# Altium schematic sheet EIT_Teensy_VCCS.SchDoc
size A3
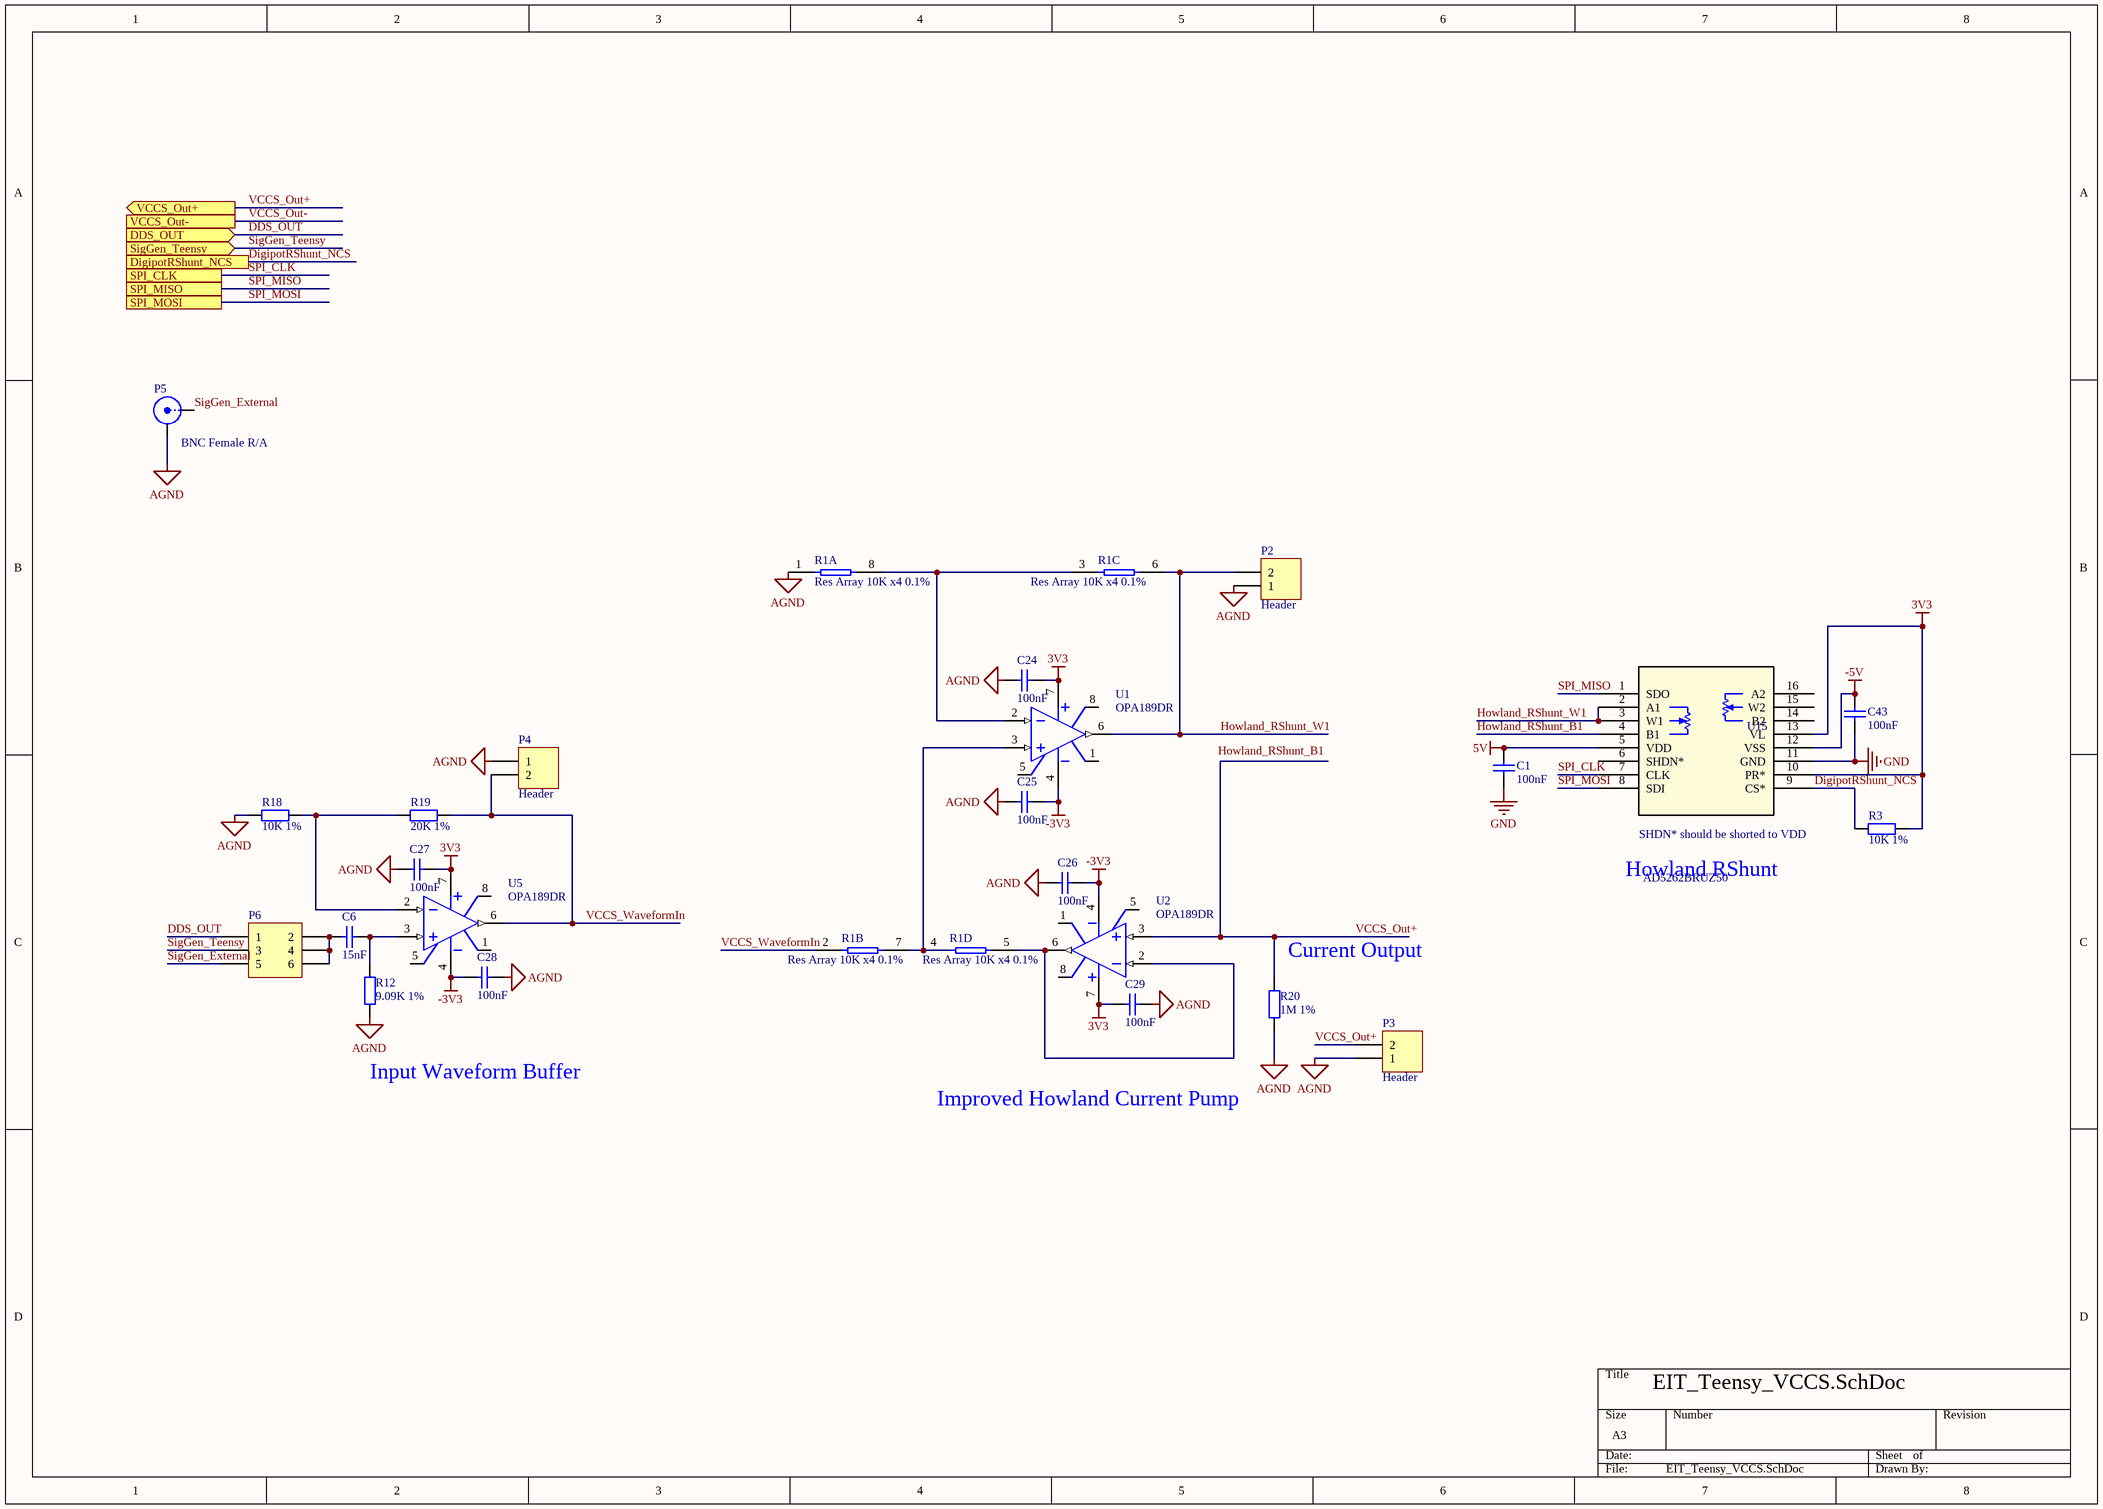
[diagram p0: EIT_Teensy_VCCS.SchDoc]

## Parts
C1  100nF  [0603 CAP]
C6  15nF  [0603 CAP]
C24  100nF  [0603 CAP]
C25  100nF  [0603 CAP]
C26  100nF  [0603 CAP]
C27  100nF  [0603 CAP]
C28  100nF  [0603 CAP]
C29  100nF  [0603 CAP]
C43  100nF  [0603 CAP]
P2  Header  [HEADER 2.54MM 2X1 MALE]
P3  Header  [HEADER 2.54MM 2X1 MALE]
P4  Header  [HEADER 2.54MM 2X1 MALE]
P5  BNC Female R/A  [BNC_RA CON]
P6  Header 3X2  [HDR2X3 Male 2.54mm]  (value not drawn)
R1  Res Array 10K x4 0.1%  [8-SOIC]  (parts A,B,C,D of 4)
R3  10K 1%  [0603 RES]
R12  9.09K 1%  [0603 RES]
R18  10K 1%  [0603 RES]
R19  20K 1%  [0603 RES]
R20  1M 1%  [0603 RES]
U1  OPA189DR  [8-SOIC]
U2  OPA189DR  [8-SOIC]
U5  OPA189DR  [8-SOIC]
U15  AD5262BRUZ50

## Ports
DDS_OUT (in), DigipotRShunt_NCS, SigGen_Teensy (in), SPI_CLK, SPI_MISO, SPI_MOSI, VCCS_Out+ (out), VCCS_Out-

## Nets
3V3: C24.2 C27.2 C29.2 R3.1 U1.7(V+) U2.7(V+) U5.7(V+) U15.10(PR*) U15.13(VL)
5V: C1.2 U15.5(VDD)
-3V3: C25.2 C26.2 C28.1 U1.4(V-) U2.4(V-) U5.4(V-)
-5V: C43.2 U15.12(VSS)
AGND: C24.1 C25.1 C26.1 C27.1 C28.2 C29.1 P2.1 P3.1 P4.1 P5.2(Y) R1.1 R12.1 R18.1 R20.2
GND: C1.1 C43.1 U15.11(GND)
DDS_OUT: P6.1 ; port DDS_OUT
DigipotRShunt_NCS: R3.2 U15.9(CS*) ; port DigipotRShunt_NCS
Howland_RShunt_B1: U15.4(B1)
Howland_RShunt_W1: P2.2 R1.6 U1.6(OUT) U15.2(A1) U15.3(W1)
SigGen_External: P5.1(X) P6.5
SigGen_Teensy: P6.3 ; port SigGen_Teensy
SPI_CLK: U15.7(CLK) ; port SPI_CLK
SPI_MISO: U15.1(SDO) ; port SPI_MISO
SPI_MOSI: U15.8(SDI) ; port SPI_MOSI
VCCS_Out+: P3.2 R20.1 U2.3(IN+) ; port VCCS_Out+
VCCS_Out-: port VCCS_Out-
VCCS_WaveformIn: P4.2 R1.2 R19.2 U5.6(OUT)
NetC6_1: C6.1 P6.2 P6.4 P6.6
NetC6_2: C6.2 R12.2 U5.3(IN+)
NetR1_3: R1.3 R1.8 U1.2(IN-)
NetR1_4: R1.4 R1.7 U1.3(IN+)
NetR1_5: R1.5 U2.2(IN-) U2.6(OUT)
NetR18_2: R18.2 R19.1 U5.2(IN-)

Not connected (* = marked no-connect by the designer): U1 1(OS_NUL) 5(OS_NUL) 8(TAB); U2 1(OS_NUL) 5(OS_NUL) 8(TAB); U5 1(OS_NUL) 5(OS_NUL) 8(TAB); U15 6(SHDN*) 14(B2) 15(W2) 16(A2)

## Notes on the sheet
- SHDN* should be shorted to VDD
- Howland RShunt
- (near R20) Current Output
- Input Waveform Buffer
- Improved Howland Current Pump
- Labels drawn without touching a wire or pin: Howland_RShunt_B1

## Library data of the parts
C1 C24-C29 C43 = Cap 0603 100nF 10% 50V: Multi Layer Ceramic Capacitor (MLCC) / Cap Ceramic 0.1uF 50V X7R 10% Pad SMD 0603 125¡ãC T/R; Manufacturer: Samsung; Manufacturer Part Number: CL10B104KB8NNNC; Supplier 1: Digi-Key; RoHS: Yes; Category: Ceramic Capacitors; Stock 1: 16768569; Pricing 1: 1=0.10000, 10=0.03000, 50=0.01620, 100=0.01330, 500=0.00950, 1000=0.00746 (USD); Mount: Surface Mount; Case/Package: 0603; Case Code (Metric): 1608; Case Code (Imperial): 0603; Material: Ceramic; Contact Plating: Tin; Min Operating Temperature: -55°C; Max Operating Temperature: 125°C; Tolerance: 10%; Package Quantity: 1; Packaging: Tape and Reel; Capacitance: 100nF; Dielectric: X7R; Series: CL; Voltage Rating: 50V; Voltage: 50V; Voltage Rating (DC): 50V; Construction: Flat; Length: 1.6mm; Width: 0.031inch; Height: 0.8mm; Depth: 0.8mm; Thickness: 0.035inch; Radiation Hardening: No; Lead Free: Lead Free; RoHS Compliant: Yes; ComponentLink1URL: https://datasheet.ciiva.com/25803/cl10b104kb8nnnc-25803393.pdf?src-supplier=Digi-Key; ComponentLink1Description: https://datasheet.ciiva.com/25803/cl10b104kb8nnnc-25803393.pdf?src-supplier=Digi-Key; ComponentLink2URL: https://datasheet.ciiva.com/26838/getdatasheetpartid-89097-26838411.pdf?src-supplier=Verical; ComponentLink2Description: https://datasheet.ciiva.com/26838/getdatasheetpartid-89097-26838411.pdf?src-supplier=Verical; ComponentLink3URL: https://datasheet.ciiva.com/29198/456651-da-01-en-vs-kondensator-0605-29198839.pdf?src-supplier=Conrad; ComponentLink3Description: https://datasheet.ciiva.com/29198/456651-da-01-en-vs-kondensator-0605-29198839.pdf?src-supplier=Conrad; Supplier Part Number 1: 1276-1000-1-ND
C6 = Cap 0603 15nF 10% 50V: Cap Ceramic 0.015uF 50V X7R 10% SMD 0603 125C T/R; Manufacturer: Yageo; Manufacturer Part Number: CC0603KRX7R9BB153; Insulation Resistance: 10GR; Dissipation Factor: 2.5%; Supplier 1: Digi-Key; RoHS: Yes; Category: Ceramic Capacitors; Stock 1: 123647; Pricing 1: 1=0.10000, 10=0.05200, 50=0.02840, 100=0.02330, 500=0.01662, 1000=0.01306 (USD); Mount: Surface Mount; Case/Package: 0603; Case Code (Metric): 1608; Case Code (Imperial): 0603; Min Operating Temperature: -55°C; Max Operating Temperature: 125°C; Tolerance: 10%; Package Quantity: 1; Packaging: Tape and Reel; Capacitance: 15nF; Dielectric: X7R; Series: CC; Voltage Rating: 50V; Length: 1.6mm; Width: 0.031inch; Height: 0.8mm; Depth: 0.8mm; Thickness: 0.035inch; Radiation Hardening: No; RoHS Compliant: Yes; ComponentLink1URL: https://datasheet.ciiva.com/26918/getdatasheetpartid-403585-26918319.pdf?src-supplier=Verical; ComponentLink1Description: https://datasheet.ciiva.com/26918/getdatasheetpartid-403585-26918319.pdf?src-supplier=Verical; ComponentLink2URL: https://datasheet.ciiva.com/176/mlccorderingcode-176402.pdf?src-supplier=Digi-Key; ComponentLink2Description: https://datasheet.ciiva.com/176/mlccorderingcode-176402.pdf?src-supplier=Digi-Key; Supplier Part Number 1: 311-1430-1-ND; Dielectric Material: Ceramic; Voltage Rating (DC): 50V; Termination: SMD/SMT; Resistor Type: Ceramic; Voltage: 50V; REACH SVHC: Unknown; Lead Free: Lead Free; Halogen Free: Halogen Free; ComponentLink3URL: https://datasheet.ciiva.com/11587/upy-gphc-x7r-6-3v-to-50v-8-11587221.pdf?src-supplier=Avnet; ComponentLink3Description: https://datasheet.ciiva.com/11587/upy-gphc-x7r-6-3v-to-50v-8-11587221.pdf?src-supplier=Avnet; ComponentLink4URL: https://datasheet.ciiva.com/176/mlccorderingcode-176400.pdf?src-supplier=Digi-Key; ComponentLink4Description: https://datasheet.ciiva.com/176/mlccorderingcode-176400.pdf?src-supplier=Digi-Key; ComponentLink5URL: https://datasheet.ciiva.com/176/mlccorderingcode-176401.pdf?src-supplier=Digi-Key; ComponentLink5Description: https://datasheet.ciiva.com/176/mlccorderingcode-176401.pdf?src-supplier=Digi-Key; ComponentLink6URL: https://datasheet.ciiva.com/17434/upy-gphc-x7r-6-3v-to-50v-8-17434649.pdf?src-supplier=Avnet+Europe; ComponentLink6Description: https://datasheet.ciiva.com/17434/upy-gphc-x7r-6-3v-to-50v-8-17434649.pdf?src-supplier=Avnet+Europe; ComponentLink7URL: https://datasheet.ciiva.com/7978/1489800-7978167.pdf?src-supplier=Element14; ComponentLink7Description: https://datasheet.ciiva.com/7978/1489800-7978167.pdf?src-supplier=Element14
P2-P4 = Header 2x1 2.54mm T/H Male: CONN HEADER VERT 2POS 2.54MM; Manufacturer: Sullins; Manufacturer Part Number: PRPC002SAAN-RC; Number of Positions: 2; Connector Type: Male Pin; Pitch: 0.1inch; Supplier 1: Digi-Key; RoHS: Yes; Category: Connectors; Stock 1: 34676; Pricing 1: 1=0.08000, 10=0.07300, 25=0.05400, 50=0.04640, 100=0.04490, 250=0.03872, 500=0.03716 (USD); Mount: Through Hole; Color: Black; Contact Plating: Gold; Package Quantity: 1; Number of Rows: 1; Termination: Solder; Packaging: Bulk; Contact Mating Length: 0.23inch; ComponentLink1URL: https://datasheet.ciiva.com/741/xrxczzzsxxn-rc-st-11635-b-741243.pdf?src-supplier=Digi-Key; ComponentLink1Description: https://datasheet.ciiva.com/741/xrxczzzsxxn-rc-st-11635-b-741243.pdf?src-supplier=Digi-Key; Supplier Part Number 1: S1011EC-02-ND
P5 = Jack BNC Female T/H R/A TE: Conn ZDC/BNC RCP 0Hz to 4GHz 50Ohm Solder RA Thru-Hole Gold Over Nickel Over Copper Individual; Manufacturer: TE Connectivity; Manufacturer Part Number: 1-1337543-0; Dielectric Material: PE; Impedance: 50R; Connector Type: BNC,Jack; Polarity: Normal; Number of Positions: 1; PCB Mount Retention: With; Sealable: No (Without); Connector System: Cable-to-Board; Operating Frequency: 0 to 4 GHz; Tail Length: 4.9mm; PCB Thickness: 0.13inch; Supplier 1: Digi-Key; RoHS: Yes; Category: RF / Coaxial Connectors; Stock 1: 4913; Pricing 1: 1=1.67000, 10=1.51800, 25=1.42520, 50=1.36300, 100=1.30110, 250=1.17716, 500=1.08424, 1000=0.92935 (USD); Contact Material: Brass; Contact Plating: Gold; Color: White; Plating: Nickel; Body Plating: Nickel; Insulation Material: Polyethylene; Housing Color: White; Min Operating Temperature: -67°C; Max Operating Temperature: 185°C; Packaging: Box; Gender: Female; Frequency: 4GHz; Package Quantity: 100; Fastening Type: Bayonet; Termination: Solder; Max Frequency: 4GHz; Orientation: Right Angle; Series: BNC; Length: 14.7mm; Depth: 34.9mm; Radiation Hardening: No; REACH SVHC: Unknown; RoHS Compliant: Yes; ComponentLink1URL: https://datasheet.ciiva.com/644/eng-cd-1337543-g-644734.pdf?src-supplier=Digi-Key; ComponentLink1Description: https://datasheet.ciiva.com/644/eng-cd-1337543-g-644734.pdf?src-supplier=Digi-Key; ComponentLink2URL: https://datasheet.ciiva.com/644/eng-cd-1337543-g-644734.pdf?src-supplier=Farnell; ComponentLink2Description: https://datasheet.ciiva.com/644/eng-cd-1337543-g-644734.pdf?src-supplier=Farnell; ComponentLink3URL: https://datasheet.ciiva.com/11763/0900766b805faaaa-11763772.pdf?src-supplier=RSComponents; ComponentLink3Description: https://datasheet.ciiva.com/11763/0900766b805faaaa-11763772.pdf?src-supplier=RSComponents; ComponentLink4URL: https://datasheet.ciiva.com/3133/eng-ds-6-1773448-5-zdc-rf-coax-50-75-ohm-1007-3133303.pdf?src-supplier=Avnet; ComponentLink4Description: https://datasheet.ciiva.com/3133/eng-ds-6-1773448-5-zdc-rf-coax-50-75-ohm-1007-3133303.pdf?src-supplier=Avnet; ComponentLink5URL: https://datasheet.ciiva.com/30238/eng-ds-6-1773448-5-zdc-rf-coax-50-75-ohm-1007-30238783.pdf?src-supplier=Onlinecomponents.com; ComponentLink5Description: https://datasheet.ciiva.com/30238/eng-ds-6-1773448-5-zdc-rf-coax-50-75-ohm-1007-30238783.pdf?src-supplier=Onlinecomponents.com; ComponentLink6URL: https://datasheet.ciiva.com/16653/eng-ds-6-1773448-5-zdc-rf-coax-50-75-ohm-1007-16653071.pdf?src-supplier=Avnet+Europe; ComponentLink6Description: https://datasheet.ciiva.com/16653/eng-ds-6-1773448-5-zdc-rf-coax-50-75-ohm-1007-16653071.pdf?src-supplier=Avnet+Europe; ComponentLink7URL: https://datasheet.ciiva.com/14567/70084602-14567445.pdf?src-supplier=Allied+Electronics; ComponentLink7Description: https://datasheet.ciiva.com/14567/70084602-14567445.pdf?src-supplier=Allied+Electronics; ComponentLink8URL: https://datasheet.ciiva.com/1115/580087-1115285.pdf?src-supplier=Element14; ComponentLink8Description: https://datasheet.ciiva.com/1115/580087-1115285.pdf?src-supplier=Element14; Supplier Part Number 1: A97553-ND
P6 = Header 3X2 2.54mm Male: Header, 3-Pin, Dual row
R1 = Res Array 10K x4 0.1%: Res Thin Film NET 10K Ohm 0.1% 0.4W ±25ppm/°C ISOL Molded Epoxy 8-Pin SOIC Gull Wing SMD Medical T/R; Manufacturer: Vishay Dale Thin Film; Manufacturer Part Number: ORNTA1002AT1; Number of Terminals/Pins: 8; Voltage Rating: 100V; Resistance: 10kR; Number of Elements: 4; Circuit Type: Isolated; Power Per Element: 100mW; Supplier 1: Digi-Key; RoHS: Yes; Category: Resistor Arrays; Stock 1: 44707; Pricing 1: 1=3.86000, 10=3.45000, 25=3.24320, 50=2.96700, 100=2.55300, 250=2.20800, 500=2.00100 (USD); Mount: Surface Mount; Case/Package: DIP; Number of Pins: 8; Min Operating Temperature: -55°C; Max Operating Temperature: 125°C; Tolerance: 0.1%; Packaging: Tape and Reel; Package Quantity: 1; Termination: SMD/SMT; Number of Resistors: 4; Temperature Coefficient: 25ppm/°C; Voltage Rating (DC): 100V; Series: ORN; Resistance Tolerance: 0.1%; Technology: THIN FILM; Length: 0.194inch; Width: 3.99mm; Height: 0.068inch; Lead Pitch: 1.27mm; Radiation Hardening: No; REACH SVHC: Unknown; RoHS Compliant: Yes; ComponentLink1URL: https://datasheet.ciiva.com/23596/1750005-23596168.pdf?src-supplier=Newark; ComponentLink1Description: https://datasheet.ciiva.com/23596/1750005-23596168.pdf?src-supplier=Newark; ComponentLink2URL: https://datasheet.ciiva.com/2691/orn-2691499.pdf?src-supplier=Digi-Key; ComponentLink2Description: https://datasheet.ciiva.com/2691/orn-2691499.pdf?src-supplier=Digi-Key; ComponentLink3URL: https://datasheet.ciiva.com/2691/orn-2691500.pdf?src-supplier=Digi-Key; ComponentLink3Description: https://datasheet.ciiva.com/2691/orn-2691500.pdf?src-supplier=Digi-Key; ComponentLink4URL: https://datasheet.ciiva.com/2691/orn-2691501.pdf?src-supplier=Digi-Key; ComponentLink4Description: https://datasheet.ciiva.com/2691/orn-2691501.pdf?src-supplier=Digi-Key; ComponentLink5URL: https://datasheet.ciiva.com/8352/orn-8352811.pdf?src-supplier=Avnet; ComponentLink5Description: https://datasheet.ciiva.com/8352/orn-8352811.pdf?src-supplier=Avnet; ComponentLink6URL: https://datasheet.ciiva.com/5036/orn-102377-5036262.pdf?src-supplier=Mouser; ComponentLink6Description: https://datasheet.ciiva.com/5036/orn-102377-5036262.pdf?src-supplier=Mouser; Supplier Part Number 1: ORNT-10KACT-ND
R3 R18 = Res 0603 10K 1%: Res General Purpose Thick Film 0603 10K Ohm 1% 1/10W ±100ppm/°C Molded SMD Paper T/R; Manufacturer: Yageo; Manufacturer Part Number: RC0603FR-0710KL; Voltage Rating: 75V; Resistance: 10kR; Power Rating: 100mW; Voltage Rating (DC): 50V; Supplier 1: Digi-Key; RoHS: Yes; Category: Chip SMD Resistors; Stock 1: 18430741; Pricing 1: 1=0.10000, 10=0.02400, 100=0.00970, 1000=0.00436, 2500=0.00378 (USD); Case/Package: 0603; Number of Pins: 2; Case Code (Imperial): 0603; Case Code (Metric): 1608; Size Code: 0603; Weight: 7.1E-05oz; Min Operating Temperature: -55°C; Max Operating Temperature: 155°C; Packaging: Tape and Reel; Tolerance: 1%; Termination: SMD/SMT; Resistor Type: Thick Film; Temperature Coefficient: 100ppm/°C; Features: Moisture Resistant; Series: RC; Max Power Dissipation: 100mW; Number of Terminations: 2; Resistance Tolerance: 1%; Construction: Rectangular; Length: 1.6mm; Width: 0.8mm; Height: 0.45mm; Depth: 0.8mm; Lead Pitch: 0.3mm; REACH SVHC: Unknown; Military Standard: Not; Lead Free: Lead Free; RoHS Compliant: Yes; ComponentLink1URL: https://datasheet.ciiva.com/15189/getdatasheetpartid-409289-15189591.pdf?src-supplier=Verical; ComponentLink1Description: https://datasheet.ciiva.com/15189/getdatasheetpartid-409289-15189591.pdf?src-supplier=Verical; ComponentLink2URL: https://datasheet.ciiva.com/7660/38590-7660789.pdf?src-supplier=Element14; ComponentLink2Description: https://datasheet.ciiva.com/7660/38590-7660789.pdf?src-supplier=Element14; ComponentLink3URL: https://datasheet.ciiva.com/7746/1738695-7746239.pdf?src-supplier=Element14; ComponentLink3Description: https://datasheet.ciiva.com/7746/1738695-7746239.pdf?src-supplier=Element14; ComponentLink4URL: https://datasheet.ciiva.com/7983/443971-7983596.pdf?src-supplier=Element14; ComponentLink4Description: https://datasheet.ciiva.com/7983/443971-7983596.pdf?src-supplier=Element14; ComponentLink5URL: https://datasheet.ciiva.com/22747/443971-22747519.pdf?src-supplier=Element14; ComponentLink5Description: https://datasheet.ciiva.com/22747/443971-22747519.pdf?src-supplier=Element14; ComponentLink6URL: https://datasheet.ciiva.com/46440/1868787-46440891.pdf?src-supplier=Element14; ComponentLink6Description: https://datasheet.ciiva.com/46440/1868787-46440891.pdf?src-supplier=Element14; Supplier Part Number 1: 311-10.0KHRCT-ND
R12 = Res 0603 9.09K 1%: Res Thick Film 0603 90.9K Ohm 1% 0.1W(1/10W) ±100ppm/C Epoxy SMD T/R; Manufacturer: Yageo; Manufacturer Part Number: RC0603FR-0790K9L; Power Rating: 100mW; Resistance: 90.9kR; Voltage Rating: 75V; Temperature Coefficient: 100ppm/°C; Voltage Rating (DC): 50V; Supplier 1: Digi-Key; RoHS: Yes; Category: Chip SMD Resistors; Stock 1: 655755; Pricing 1: 1=0.10000, 10=0.02400, 100=0.00970, 1000=0.00436, 2500=0.00378 (USD); Case/Package: 0603; Case Code (Imperial): 0603; Case Code (Metric): 1608; Size Code: 0603; Min Operating Temperature: -55°C; Max Operating Temperature: 155°C; Tolerance: 1%; Packaging: Tape and Reel; Termination: SMD/SMT; Resistor Type: Thick Film; Features: Moisture Resistant; Series: RC; Max Power Dissipation: 100mW; Number of Terminations: 2; Construction: Rectangular; Length: 1.6mm; Height: 0.45mm; Depth: 0.8mm; Military Standard: Not; Lead Free: Lead Free; RoHS Compliant: Yes; ComponentLink1URL: https://datasheet.ciiva.com/15189/getdatasheetpartid-325203-15189835.pdf?src-supplier=Verical; ComponentLink1Description: https://datasheet.ciiva.com/15189/getdatasheetpartid-325203-15189835.pdf?src-supplier=Verical; Supplier Part Number 1: 311-90.9KHRCT-ND; Weight: 7.1E-05oz; Width: 0.8mm
R19 = Res 0603 20K 1%: Res General Purpose Thick Film 0603 20K Ohm 1% 1/10W ±100ppm/°C Molded SMD Paper T/R; Manufacturer: Yageo; Manufacturer Part Number: RC0603FR-0720KL; Resistance: 20kR; Voltage Rating (DC): 50V; Power Rating: 100mW; Supplier 1: Digi-Key; RoHS: Yes; Category: Chip SMD Resistors; Stock 1: 2390662; Pricing 1: 1=0.10000, 10=0.02400, 100=0.00970, 1000=0.00436, 2500=0.00378 (USD); Case/Package: 0603; Case Code (Imperial): 0603; Case Code (Metric): 1608; Size Code: 0603; Min Operating Temperature: -55°C; Max Operating Temperature: 155°C; Tolerance: 1%; Packaging: Tape and Reel; Features: Moisture Resistant; Series: RC; Voltage Rating: 50V; Termination: SMD/SMT; Resistor Type: Thick Film; Temperature Coefficient: 100ppm/°C; Max Power Dissipation: 100mW; Number of Terminations: 2; Construction: Rectangular; Length: 0.063inch; Width: 0.031inch; Height: 0.022inch; Depth: 0.8mm; Lead Free: Lead Free; RoHS Compliant: Yes; Military Standard: Not; ComponentLink1URL: https://datasheet.ciiva.com/11808/0900766b80f96399-11808275.pdf?src-supplier=RSComponents; ComponentLink1Description: https://datasheet.ciiva.com/11808/0900766b80f96399-11808275.pdf?src-supplier=RSComponents; Supplier Part Number 1: 311-20.0KHRCT-ND; Number of Pins: 2; Package Quantity: 1; Resistance Tolerance: 1%; Technology: THICK FILM; REACH SVHC: No SVHC; ComponentLink2URL: https://datasheet.ciiva.com/2453/pyu-r-int-thick-7-2453910.pdf?src-supplier=Digi-Key; ComponentLink2Description: https://datasheet.ciiva.com/2453/pyu-r-int-thick-7-2453910.pdf?src-supplier=Digi-Key; ComponentLink3URL: https://datasheet.ciiva.com/2453/pyu-r-int-thick-7-2453911.pdf?src-supplier=Digi-Key; ComponentLink3Description: https://datasheet.ciiva.com/2453/pyu-r-int-thick-7-2453911.pdf?src-supplier=Digi-Key; ComponentLink4URL: https://datasheet.ciiva.com/2453/pyu-r-int-thick-7-2453912.pdf?src-supplier=Digi-Key; ComponentLink4Description: https://datasheet.ciiva.com/2453/pyu-r-int-thick-7-2453912.pdf?src-supplier=Digi-Key; ComponentLink5URL: https://datasheet.ciiva.com/22747/443971-22747525.pdf?src-supplier=Element14; ComponentLink5Description: https://datasheet.ciiva.com/22747/443971-22747525.pdf?src-supplier=Element14
R20 = Res 0603 1M 1%: Yageo RC Series Thick Film Surface Mount Resistor 0603 Case 1M 1% 0.1W 100ppm/C; Manufacturer Part Number: RC0603FR-071ML; Voltage Rating: 75V; Voltage Rating (DC): 50V; Resistance: 1MR; Power Rating: 100mW; Temperature Coefficient: 100ppm/°C; Application(s): HIGH RELIABILITY; Supplier 1: Digi-Key; Manufacturer: Yageo; RoHS: Yes; Category: Chip SMD Resistors; Stock 1: 4599128; Pricing 1: 1=0.10000, 10=0.02400, 100=0.00970, 1000=0.00436, 2500=0.00378 (USD); Case/Package: 0603; Number of Pins: 2; Case Code (Imperial): 0603; Case Code (Metric): 1608; Weight: 0.000847oz; Min Operating Temperature: -55°C; Max Operating Temperature: 155°C; Tolerance: 1%; Packaging: Cut Tape; Package Quantity: 5000; Termination: SMD/SMT; Resistor Type: Thick Film; Series: RC; Technology: THICK FILM; Type: General Purpose; Length: 1.6mm; Width: 0.8mm; Height: 0.45mm; Depth: 0.8mm; REACH SVHC: No SVHC; Military Standard: Not; Lead Free: Lead Free; RoHS Compliant: Yes; ComponentLink1URL: https://datasheet.ciiva.com/11819/0900766b80f96399-11819295.pdf?src-supplier=RSComponents; ComponentLink1Description: https://datasheet.ciiva.com/11819/0900766b80f96399-11819295.pdf?src-supplier=RSComponents; ComponentLink2URL: https://datasheet.ciiva.com/12555/rc0603-272842-12555388.pdf?src-supplier=Mouser; ComponentLink2Description: https://datasheet.ciiva.com/12555/rc0603-272842-12555388.pdf?src-supplier=Mouser; Supplier Part Number 1: 311-1.00MHRCT-ND
U1 U2 U5 = OpAmp OPA189DR: 36V ZERO DRIFT OP-AMP; Manufacturer: Texas Instruments; Manufacturer Part Number: OPA189IDR; Number of Channels: 1; Slew Rate: 20V/µs; Gain Bandwidth Product: 14MHz; Input Bias Current: 70pA; Input Offset Voltage (Vos): 0.4uV; Operating Supply Current: 1.3mA; Supplier 1: Digi-Key; RoHS: Yes; Category: Amplifiers - Op Amps, Buffer, Instrumentation; Stock 1: 9768; Pricing 1: 1=2.85000, 10=2.56500, 25=2.41960, 100=2.06140, 250=1.93556, 500=1.69362, 1000=1.52471 (USD); Mount: Surface Mount; Case/Package: SOIC; Number of Pins: 8; Min Operating Temperature: -40°C; Max Operating Temperature: 125°C; Packaging: Tape and Reel; Number of Circuits: 1; RoHS Compliant: Yes; ComponentLink1URL: http://www.ti.com/lit/ds/symlink/opa189.pdf?src-supplier=Digi-Key; ComponentLink1Description: http://www.ti.com/lit/ds/symlink/opa189.pdf?src-supplier=Digi-Key; Supplier Part Number 1: 296-48941-1-ND
U15 = AD5262BRUZ50: Digital Potentiometer, 2 Func, 50000ohm, 3-wire Serial Control Interface, 256 Positions, PDSO16; Manufacturer: Analog Devices; Number of Positions: 256; Package Body Material: Plastic; Bandwidth-Nom: 130Hz; Negative Supply Voltage-Nom: -5V; Channels: 2; Package Equivalence Code: TSSOP16,.25; Power Supplies: 5/15/+-5V; Resistance Law: Linear; Resistance Tolerance-Max: 30%; Resistor Terminal Voltage-Max: 5V; Temperature Coefficient-Nom: 35ppm/°C; Time @ Peak Reflow Temperature-Max (s): 30s; Total Resistance-Nom: 50kR; Qualification Status: Not Qualified; Manufacturer Part Number: AD5262BRUZ50; RoHS: Yes; Category: Digital Potentiometers; Case/Package: TSSOP; Min Operating Temperature: -40°C; Max Operating Temperature: 85°C; Length: 5mm; Width: 4.4mm; RoHS Compliant: Yes; ComponentLink1URL: https://datasheet.ciiva.com:443/pdfs/VipMasterIC/IC/ANDI/ANDIS19757/ANDIS19757-1.pdf?src-supplier=IHS+Markit; ComponentLink1Description: https://datasheet.ciiva.com:443/pdfs/VipMasterIC/IC/ANDI/ANDIS19757/ANDIS19757-1.pdf?src-supplier=IHS+Markit; ComponentLink2URL: https://datasheet.ciiva.com/3045/ad5260-5262-3045560.pdf?src-supplier=Avnet; ComponentLink2Description: https://datasheet.ciiva.com/3045/ad5260-5262-3045560.pdf?src-supplier=Avnet; ComponentLink3URL: https://datasheet.ciiva.com/1331/ad5260-5262-1331021.pdf?src-supplier=Digi-Key; ComponentLink3Description: https://datasheet.ciiva.com/1331/ad5260-5262-1331021.pdf?src-supplier=Digi-Key; Supplier: Digi-Key; Supplier Part Number: 505-AD5262BRUZ50-ND; Stock: 1452; Pricing: 1=6.18, 10=5.581, 25=5.3212, 100=4.6203, 250=4.41268, 500=4.02334, 1000=3.5042, 2500=3.37441 (USD); Pins: 16; Reach SVHC Compliant: Yes; Package Shape: Rectangular; Terminal Finish: Tin; JESD-609 Code: e3; Control Interface: 3-WIRE SERIAL; Converter Type: DIGITAL POTENTIOMETER; JESD-30 Code: R-PDSO-G16; Moisture Sensitivity Level: 1; Package Style: SMALL OUTLINE, THIN PROFILE, SHRINK PITCHMeter; Peak Reflow Temperature (Cel): 260°C; Resistor Terminal Voltage-Min: -5V; Nominal Supply Voltage: 5V; Surface Mount: Yes; Terminal Form: Gull Wing; Terminal Position: DUAL; Height - Seated (Max): 1.2mm; Terminal Pitch: 0.65mm; Temperature Grade: INDUSTRIAL; ComponentLink4URL: https://datasheet.ciiva.com/22652/686036-22652986.pdf?src-supplier=Element14; ComponentLink4Description: https://datasheet.ciiva.com/22652/686036-22652986.pdf?src-supplier=Element14